# Altium project Debug IO Board.PrjPcb
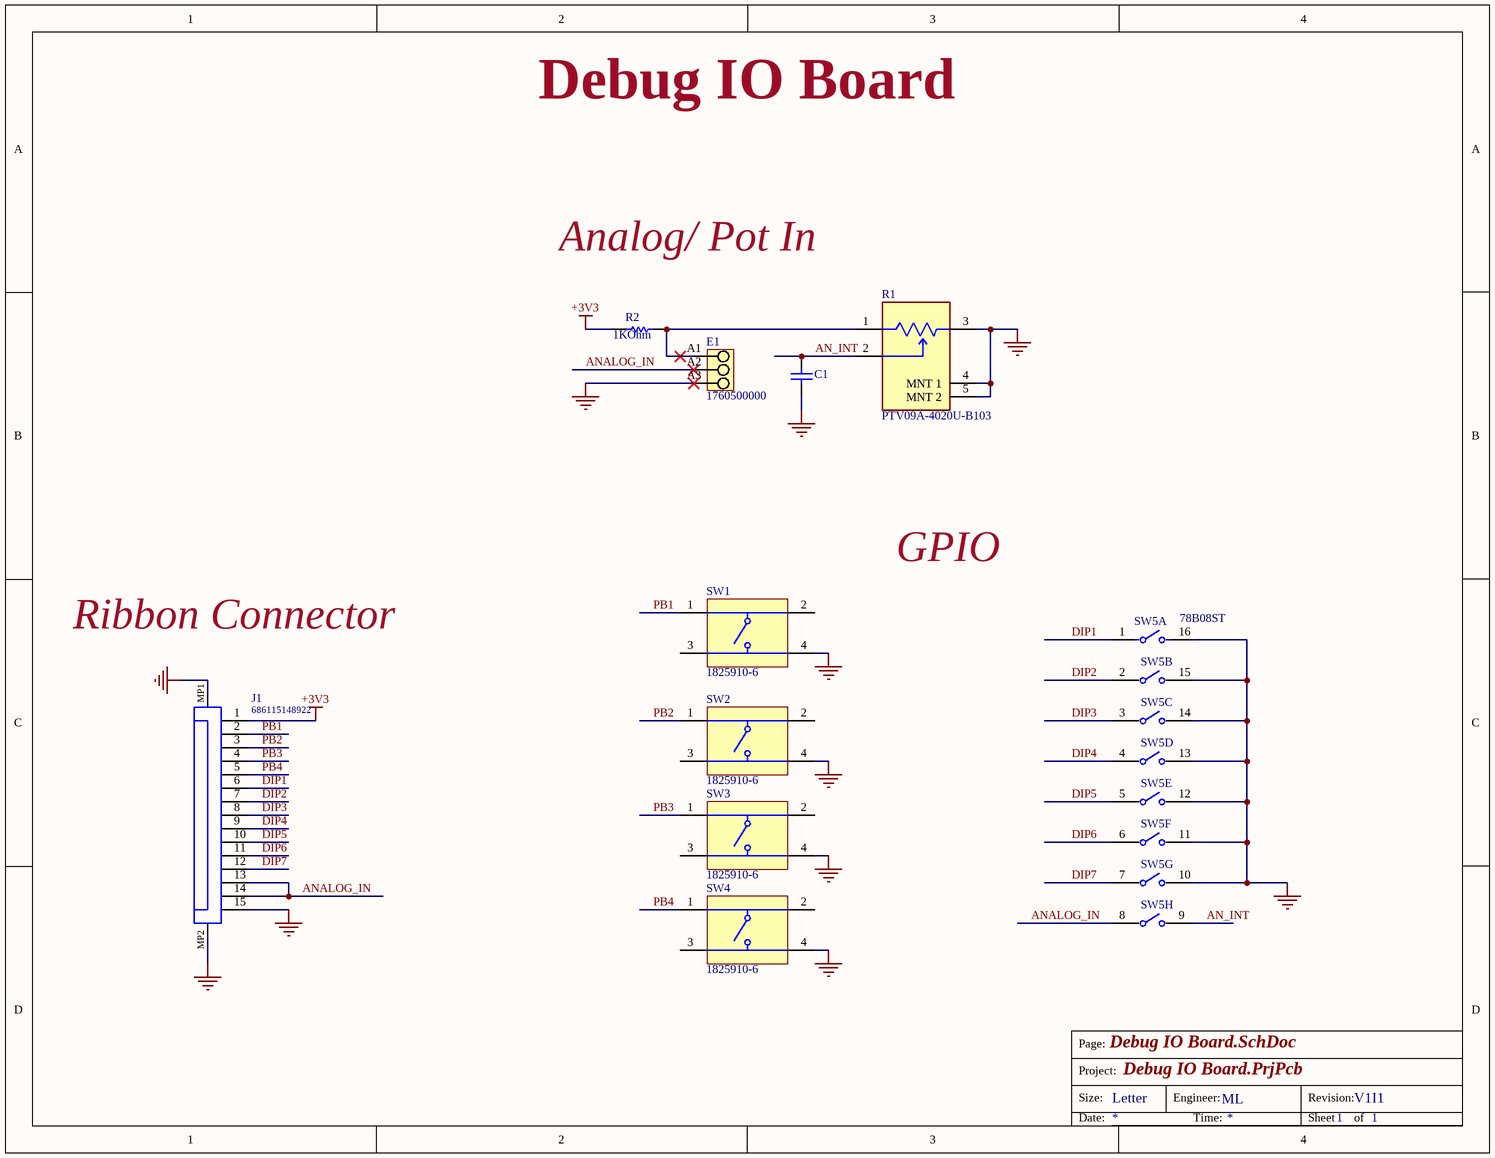
[diagram p0: Debug IO Board.SchDoc]
VersionRevision: V1I1
1 sheet, 10 parts. Net scope: global (net labels, ports and power ports of the same name join across sheets).
Board file: Debug IO Board.PcbDoc

## Sheet Debug IO Board.SchDoc
size Letter; Revision: V1I1; SheetNumber: 1; SheetTotal: 1

### Parts
C1  C0805C105K4PACTU  [CAPC2013X145X50LL20T25]  (value not drawn)
E1  1760500000  [PM_5_08_90_03]
J1  686115148922  [686115148922]
R1  PTV09A-4020U-B103  [FP-PTV09A-4-MFG]
R2  Resistance: 1KOhm  [RESC2013X60X35ML10T20]  (hidden comment: RC0805FR-071KL)
SW1  1825910-6  [TECO-1825910-6_V]
SW2  1825910-6  [TECO-1825910-6_V]
SW3  1825910-6  [TECO-1825910-6_V]
SW4  1825910-6  [TECO-1825910-6_V]
SW5  78B08ST  [FP-78B08ST-MFG]  (parts A,B,C,D,E,F,G,H of 8)

### Nets
+3V3: J1.1 R2.1
GND: C1.1 E1.A3 J1.15 J1.MP1 J1.MP2 R1.3 R1.4(MNT_1) R1.5(MNT_2) SW1.4 SW2.4 SW3.4 SW4.4 SW5.10 SW5.11 SW5.12 SW5.13 SW5.14 SW5.15 SW5.16
AN_INT: C1.2 R1.2 SW5.9
ANALOG_IN: E1.A2 J1.13 J1.14 SW5.8
DIP1: J1.6 SW5.1
DIP2: J1.7 SW5.2
DIP3: J1.8 SW5.3
DIP4: J1.9 SW5.4
DIP5: J1.10 SW5.5
DIP6: J1.11 SW5.6
DIP7: J1.12 SW5.7
PB1: J1.2 SW1.1
PB2: J1.3 SW2.1
PB3: J1.4 SW3.1
PB4: J1.5 SW4.1
NetE1_A1: E1.A1 R1.1 R2.2

Not connected (* = marked no-connect by the designer): SW1 2 3; SW2 2 3; SW3 2 3; SW4 2 3

### Notes on the sheet
- Debug IO Board
- Analog/ Pot In
- GPIO
- Ribbon Connector
- Page:
- Size:
- Project:
- Letter
- Engineer:
- ML
- Revision:
- Date:
- Time:
- Sheet
- of

### Library data of the parts
C1 = CMP-2007-01016-1: Manufacturer: Kemet; Part Number: C0805C105K4PACTU
E1 = CMP-1559-01629-1: OMNIMATE Signal - series PM; Manufacturer: Weidmueller; Pitch_mm: 5,08 mm; Pitch_inch: 0,2 inch; Wire_cross_section_AWG_min_UL_1059: AWG 26; Contact_surface: tinned; Contact_material: Cu-Leg; Short_text_for_material: PM 5.08/03/90 3.5SN OR BX; Rated_voltage_use_group_B_UL_1059: 300 V; Solid_min_H05_07_V_U: 0,13 mm²; Solder_pin_length_mm: 3,5 mm; Rated_voltage_for_surge_voltage_class_pollution_degree_II_2: 600 V; Mounting_onto_the_PCB: Solder connection; Solid_max_H05_07_V_U: 2,5 mm²; Side_termination_characteristic: closed side; Rated_current_use_group_B_UL_1059: 15 A; Wire_cross_section_AWG_max_UL_1059: AWG 14; Insulating_material: Wemid (PA); UL_94_flammability_rating: V-0; No_of_poles: 3; ComponentLink2Description: URL Link1; ComponentLink1Description: Manufacturer URL; PartNumber: 1760500000; ComponentLink2URL: http://catalog.weidmueller.com/catalog/Start.do?localeId=en&ObjectID=1760500000; ComponentLink1URL: http://www.weidmueller.com/; Qty: 500 PCS; Colour: Orange; Packaging: Box; Revision: V1; PackageReference: PM_5_08_90_03
J1 = CMP-1502-01518-1: SMT ZIF Connectors Hinge Type WR-FPC, Horizontal, Bottom Contact, pitch 1 mm, 15 pins; Manufacturer: Wurth Elektronik; Withstanding Voltage: 500VAC; Contact Resistance: 50mOhm; Pitch: 1mm; Rated Current: 1A; Working Voltage: 100VAC; Pin Number: 15; Publisher: WurthElektronik; Part Number: 686115148922; Packaging: TapeandReel; Operating Temperature: -40to105degC; Contact Design: BottomContact; Manufacturer URL: http://www.we-online.de; Mounting Technology: SMT; Orientation: Horizontal; Package Reference: 686115148922; Datasheet URL: https://katalog.we-online.de/em/datasheet/686115148922.pdf
R1 = CMP-07234-000013-1: POT 10K OHM 1/20W CARBON LINEAR; Manufacturer: Bourns Inc.; Voltage Rating: 50V; Resistance: 10kΩ; Tolerance: 20%; Value: 10kΩ; Power Rating: 0.05W; Composition: Carbon; Lead Free: Yes; Device Class L1: Passive Components; Device Class L3: Variable Resistors and Potentiometers; Temperature: -10°C to +50°C; Series: PTV09; Manufacturer Part Number: PTV09A-4020U-B103; Device Class L2: Resistors; Temperature Range Low: -10°C; Height: 20.5mm; Temperature Range High: +50°C; Octopart: https://octopart.com/ptv09a-4020u-b103-bourns-1878033; Digikey Description: POT 10K OHM 1/20W CARBON LINEAR; RoHS: TRUE; ComponentLink2URL: https://www.bourns.com/docs/product-datasheets/ptv09.pdf?sfvrsn=5e1089f1_12; Package: PTV09A-4; Mouser Description: Potentiometers 10K LINEAR 20%; Category: Res; ComponentLink2Description: Datasheet; Automotive: No
R2 = CMP-2100-03671-1: Chip Resistor, 1 KOhm, +/- 1%, 125 mW, -55 to 155 degC, 0805 (2012 Metric), RoHS, Tape and Reel; Manufacturer: Yageo; Temperature Coefficient: 100ppm/degreesC; Voltage Rating (DC): 150V; Max Power Dissipation: 125mW; Number of Pins: 2; Number of Terminations: 2; Datasheet URL: http://www.yageo.com/NewPortal/yageodocoutput?fileName=/pdf/R-Chip/PYu-RC_Group_51_RoHS_L_5.pdf; Length: 0.079inch; Package Description: 2-Pin Surface Mounted Device, Body 2 x 1.25 mm; Depth: 1.25mm; Height: 0.024inch; Military Standard: Not; Case/Package: 0805; Package Reference: 0805; RoHSCompliant: true; Lead Free: LeadFree; Packaging: TapeandReel; Package Quantity: 1; Datasheet Version: Rev. 5, 10/2016; Tolerance: 1%; Min Operating Temperature: -55degC; Voltage Rating: 150V; Composition: ThickFilm; Case Code (Imperial): 0805; Power Rating: 125mW; Width: 0.049inch; Case Code (Metric): 2012; Manufacturer URL: http://www.yageo.com/; Max Operating Temperature: 155degC; REACH SVHC: Unknown; Termination: SMD/SMT
SW1-SW4 = CMP-1684-00021-1: Tact Switch, SPST-NO, 0.05 A, -35 to 85 degC, 4-Pin THD, RoHS, Bulk; Manufacturer: TE Connectivity; Maximum Contact Resistance: 100mOhm; Mechanical Life: 100000Cycles; Bushing Type: Unthreaded; Switch Configuration: OFF(ON); Maximum DC Voltage Rating: 24V; Contact Rating @ Voltage: 0.05A@24VDC; Actuator Color: Black; Body Orientation: Straight; Function: MomentaryContact; Illumination: N/R; Actuator Style: RoundButton; Actuator Material: PolybutyleneTerephthalate; Dielectric Strength: 500VAC; Pole Throw Configuration: SPST; Actuator Length: 1.4mm; Product Weight: N/A; Contact Material: CopperAlloy; Housing Material: N/A; Terminal Type: PCPins; Minimum Insulation Resistance: 100MOhm; Package Description: 4-Pin Through Hole Device, Body 5.99 x 5.99 mm, Pitch 6.5 mm; Part No: 1825910-6; Package Reference: THD; Base Material: N/A; Manufacturer URL: http://www.te.com; Contact Plating: Silver; RoHS: Yes; Datasheet Version: Rev. C9; Electrical Life: 100000Cycles; Maximum AC Voltage Rating: N/A; Thread Size: N/R; Operating Temperature: -35to85C; Mounting: ThroughHole; Dimension: 5.99x5mm; Datasheet URL: http://www.te.com/commerce/DocumentDelivery/DDEController?Action=showdoc&DocId=Customer+Drawing%7F1825910%7FC9%7Fpdf%7FEnglish%7FENG_CD_1825910_C9.pdf%7F1825910-6; Family: 1825910; Seal Location: N/A; Seal Description: N/A; Packaging: N/A
SW5 = CMP-31942-000004-1: SWITCH SLIDE DIP SPST 150MA 30V; Manufacturer: Grayhill; Electromechanical Life: 2000Cycles; Standoff Height: 0.46mm; Number Of Circuits: 8; Contact Resistance: 30mΩ; Lead Free: Yes; Device Class L2: Switches; Contact Current Rating: 150mA; ComponentLink2URL: http://www.grayhill.com/assets/1/7/DIP_Series_78_SPST-4PST.pdf#bookmark=id.nagx8c1orts0; Device Class L1: Electromechanical; Mount: Through Hole; Mouser Description: DIP Switches / SIP Switches DIP Switch SPST 8 Pos Tape Seal; Temperature Range High: +85°C; Manufacturer Part Number: 78B08ST; Voltage Rating Dc: 30V; Device Class L3: DIP Switches; ComponentLink2Description: Datasheet; Throw Configuration: SPST; Height: 8.05mm; RoHS: TRUE; Temperature Range Low: -40°C; Package: 78B08ST; Digikey Description: SWITCH SLIDE DIP SPST 150MA 30V; Octopart: https://octopart.com/78b08st-grayhill-913939; Category: Switch; Automotive: No; Temperature: -40°C to +85°C